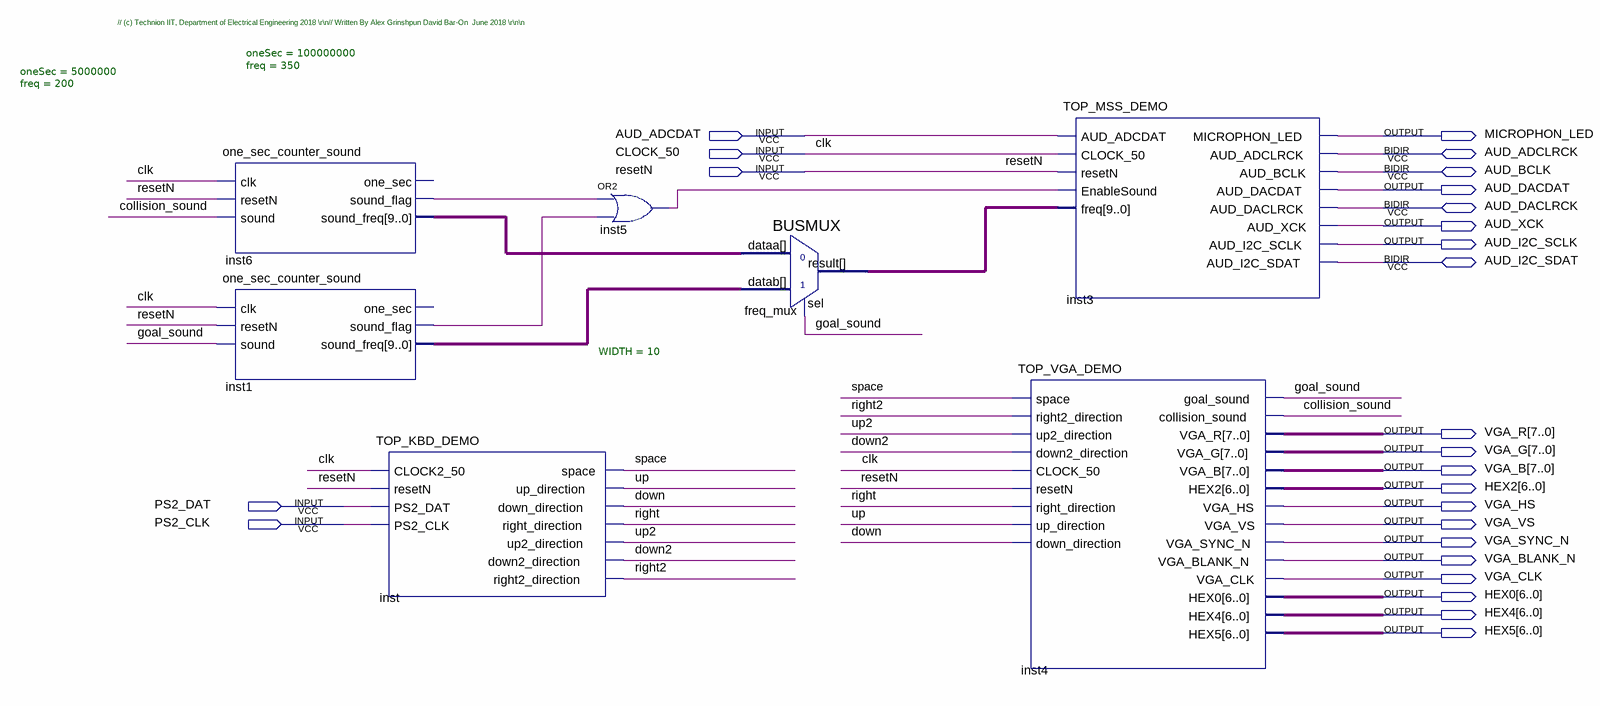
[diagram p0: schematic sheet]
// Quartus schematic TOP_Lab1_DEMO.bdf as structural Verilog: 7 symbols, 25 pins
module TOP_Lab1_DEMO (
  input  AUD_ADCDAT,
  input  CLOCK_50,
  input  resetN,
  input  PS2_DAT,
  input  PS2_CLK,
  inout  AUD_ADCLRCK,
  inout  AUD_BCLK,
  inout  AUD_DACLRCK,
  inout  AUD_I2C_SDAT,
  output MICROPHON_LED,
  output AUD_DACDAT,
  output AUD_XCK,
  output AUD_I2C_SCLK,
  output [7:0] VGA_R,
  output [7:0] VGA_G,
  output [7:0] VGA_B,
  output [6:0] HEX2,
  output VGA_HS,
  output VGA_VS,
  output VGA_SYNC_N,
  output VGA_BLANK_N,
  output VGA_CLK,
  output [6:0] HEX0,
  output [6:0] HEX4,
  output [6:0] HEX5
);

  wire collision_sound, down, down2, goal_sound, inst1_sound_flag, inst5_out, inst6_sound_flag, right,
       right2, space, up, up2;
  wire [9:0] freq_mux_result, inst1_sound_freq, inst6_sound_freq;

  one_sec_counter_sound #(.oneSec(5000000), .freq(200)) inst6 (
    .clk(CLOCK_50), .resetN(resetN), .sound(collision_sound), .sound_flag(inst6_sound_flag),
    .sound_freq(inst6_sound_freq));  // open: one_sec
  one_sec_counter_sound #(.oneSec(100000000), .freq(350)) inst1 (
    .clk(CLOCK_50), .resetN(resetN), .sound(goal_sound), .sound_flag(inst1_sound_flag),
    .sound_freq(inst1_sound_freq));  // open: one_sec
  TOP_KBD_DEMO inst (
    .CLOCK2_50(CLOCK_50), .resetN(resetN), .PS2_DAT(PS2_DAT), .PS2_CLK(PS2_CLK), .space(space),
    .up_direction(up), .down_direction(down), .right_direction(right), .up2_direction(up2),
    .down2_direction(down2), .right2_direction(right2));
  or inst5 (inst5_out, inst6_sound_flag, inst1_sound_flag);
  BUSMUX #(.WIDTH(10)) freq_mux (
    .datab(inst1_sound_freq), .sel(goal_sound), .dataa(inst6_sound_freq), .result(freq_mux_result));
  TOP_VGA_DEMO inst4 (
    .space(space), .right2_direction(right2), .up2_direction(up2), .down2_direction(down2),
    .CLOCK_50(CLOCK_50), .resetN(resetN), .right_direction(right), .up_direction(up), .down_direction(down),
    .goal_sound(goal_sound), .collision_sound(collision_sound), .VGA_R(VGA_R), .VGA_G(VGA_G), .VGA_B(VGA_B),
    .HEX2(HEX2), .VGA_HS(VGA_HS), .VGA_VS(VGA_VS), .VGA_SYNC_N(VGA_SYNC_N), .VGA_BLANK_N(VGA_BLANK_N),
    .VGA_CLK(VGA_CLK), .HEX0(HEX0), .HEX4(HEX4), .HEX5(HEX5));
  TOP_MSS_DEMO inst3 (
    .AUD_ADCDAT(AUD_ADCDAT), .CLOCK_50(CLOCK_50), .resetN(resetN), .EnableSound(inst5_out),
    .freq(freq_mux_result), .MICROPHON_LED(MICROPHON_LED), .AUD_DACDAT(AUD_DACDAT), .AUD_XCK(AUD_XCK),
    .AUD_I2C_SCLK(AUD_I2C_SCLK), .AUD_ADCLRCK(AUD_ADCLRCK), .AUD_BCLK(AUD_BCLK), .AUD_DACLRCK(AUD_DACLRCK),
    .AUD_I2C_SDAT(AUD_I2C_SDAT));

  // Other names for the same wires on the sheet: clk = CLOCK_50

  // Notes on the sheet:
  //   // (c) Technion IIT, Department of Electrical Engineering 2018 \r\n// Written By Alex Grinshpun David Bar-On  June 2018 \r\n\n
endmodule
